# EAGLE design langProject (EAGLE 8.0.1)
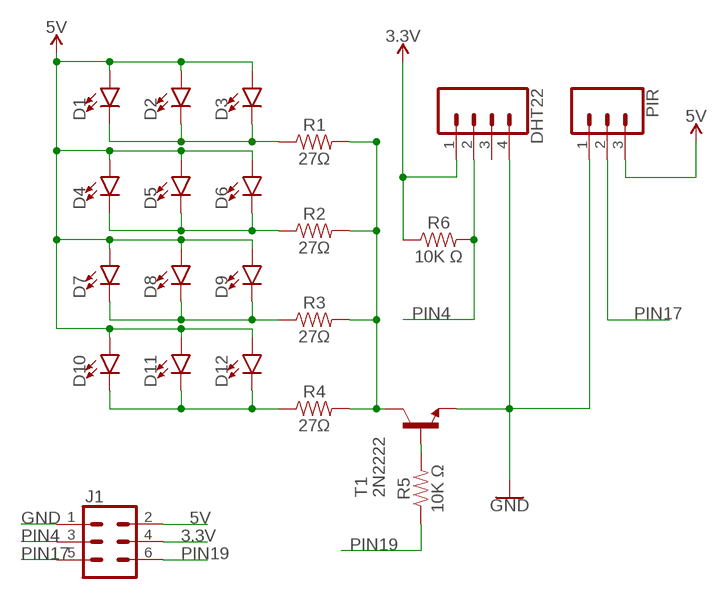
[diagram p0: schematic, sheet 1]

## Parts
D1  LED5MM  [LED_5MM]
D2  LED5MM  [LED_5MM]
D3  LED5MM  [LED_5MM]
D4  LED5MM  [LED_5MM]
D5  LED5MM  [LED_5MM]
D6  LED5MM  [LED_5MM]
D7  LED5MM  [LED_5MM]
D8  LED5MM  [LED_5MM]
D9  LED5MM  [LED_5MM]
D10  LED5MM  [LED_5MM]
D11  LED5MM  [LED_5MM]
D12  LED5MM  [LED_5MM]
DHT22  CONN_04LONGPADS  [1X04_LONGPADS]
J1  CONN_03X2SHROUD  [2X3-SHROUDED]
PIR  CONN_03LONGPADS  [1X03_LONGPADS]
R1  27Ω  10OHM-HORIZ_KIT-1/4W-1%  [AXIAL-0.3-KIT]
R2  27Ω  10OHM-HORIZ_KIT-1/4W-1%  [AXIAL-0.3-KIT]
R3  27Ω  10OHM-HORIZ_KIT-1/4W-1%  [AXIAL-0.3-KIT]
R4  27Ω  10OHM-HORIZ_KIT-1/4W-1%  [AXIAL-0.3-KIT]
R5  10K Ω  10OHM-HORIZ_KIT-1/4W-1%  [AXIAL-0.3-KIT]
R6  10K Ω  10OHM-HORIZ_KIT-1/4W-1%  [AXIAL-0.3-KIT]
T1  2N2222  [TO92-EBC-OVAL]

## Nets
3.3V: DHT22.1 J1.4 R6.P$1
5V: D1.A D2.A D3.A D4.A D5.A D6.A D7.A D8.A D9.A D10.A D11.A D12.A J1.2 PIR.3
GND: DHT22.4 J1.1 PIR.1 T1.E
N$1: D1.K(C) D2.K(C) D3.K(C) R1.P$1
N$2: D4.K(C) D5.K(C) D6.K(C) R2.P$1
N$3: D7.K(C) D8.K(C) D9.K(C) R3.P$1
N$4: R5.P$2 T1.B
N$5: D10.K(C) D11.K(C) D12.K(C) R4.P$1
N$6: R1.P$2 R2.P$2 R3.P$2 R4.P$2 T1.C
PIN4: DHT22.2 J1.3 R6.P$2
PIN17: J1.5 PIR.2
PIN19: J1.6 R5.P$1
Unconnected: DHT22.3

## Library data of the parts
D1-D12 = SparkFun-LED:LED: LED (Generic) Standard schematic elements and footprints for 5mm, 3mm, 1206, and 0603 sized LEDs. Generic LEDs with no color specified.
DHT22 = SparkFun-Connectors:CONN_04: Multi connection point. Often used as Generic Header-pin footprint for 0.1 inch spaced/style header connections On any of the 0.1 inch spaced packages, you can populate with these: Break Away Headers - Straight <https://www.sparkfun.com/products/116> (PRT-00116) Break Away Male Headers - Right Angle <https://www.sparkfun.com/products/553> (PRT-00553) Female Headers <https://www.sparkfun.com/products/115> (PRT-00115) Break Away Headers - Machine Pin <https://www.sparkfun.com/products/117> (PRT-00117) Break Away Female Headers - Swiss Machine Pin <https://www.sparkfun.com/products/743> (PRT-00743) For SCREWTERMINALS and SPRING TERMINALS visit here: Screw Terimnals on SparkFun.com <https://www.sparkfun.com/search/results?term=Screw+Terminals> (5mm/3.5mm/2.54mm spacing) This device is also useful as a general connection point to wire up your design to another part of your project. Our various solder wires solder well into these plated through hole pads. Hook-Up Wire - Assortment (Stranded, 22 AWG) <https://www.sparkfun.com/products/11375> (PRT-11375) Hook-Up Wire - Assortment (Solid Core, 22 AWG) <https://www.sparkfun.com/products/11367> (PRT-11367) View the entire wire category on our website here <https://www.sparkfun.com/categories/141> Special notes: Molex polarized connector foot print use with SKU : PRT-08231 with associated crimp pins and housings. 1MM SMD Version SKU: PRT-10208; PROD_ID: CONN-09696
J1 = SparkFun-Connectors:CONN_03X2: Multi connection point. Often used as Generic Header-pin footprint for 0.1 inch spaced/style header connections You can populate with any combo of single row headers, but if you'd like an exact match, check these: Header - 2x3 (Male, 0.1") <https://www.sparkfun.com/products/12807> (PRT-12807) Header - 2x3 (Female, 0.1") <https://www.sparkfun.com/products/13010> (PRT-13010) 2x3 Pin Shrouded Header <https://www.sparkfun.com/products/10877> (PRT-10877) On any of the 0.1 inch spaced packages, you can populate with these: Break Away Headers - Straight <https://www.sparkfun.com/products/116> (PRT-00116) Break Away Male Headers - Right Angle <https://www.sparkfun.com/products/553> (PRT-00553) Female Headers <https://www.sparkfun.com/products/115> (PRT-00115) Break Away Headers - Machine Pin <https://www.sparkfun.com/products/117> (PRT-00117) Break Away Female Headers - Swiss Machine Pin <https://www.sparkfun.com/products/743> (PRT-00743) Special note: the shrouded connector mates well with our 3x2 ribbon cables: Ribbon Crimp Connector - 6-pin (2x3, Female) <https://www.sparkfun.com/products/10651> (PRT-10651) Ribbon Cable - 6 wire (15ft) <https://www.sparkfun.com/products/10646> (PRT-10646); PROD_ID: CONN-10681; SF_ID: PRT_10877
PIR = SparkFun-Connectors:CONN_03: Multi connection point. Often used as Generic Header-pin footprint for 0.1 inch spaced/style header connections On any of the 0.1 inch spaced packages, you can populate with these: Break Away Headers - Straight <https://www.sparkfun.com/products/116> (PRT-00116) Break Away Male Headers - Right Angle <https://www.sparkfun.com/products/553> (PRT-00553) Female Headers <https://www.sparkfun.com/products/115> (PRT-00115) Break Away Headers - Machine Pin <https://www.sparkfun.com/products/117> (PRT-00117) Break Away Female Headers - Swiss Machine Pin <https://www.sparkfun.com/products/743> (PRT-00743) Stackable Header - 3 Pin (Female, 0.1") <https://www.sparkfun.com/products/13875> (PRT-13875) For SCREWTERMINALS and SPRING TERMINALS visit here: Screw Terimnals on SparkFun.com <https://www.sparkfun.com/search/results?term=Screw+Terminals> (5mm/3.5mm/2.54mm spacing) This device is also useful as a general connection point to wire up your design to another part of your project. Our various solder wires solder well into these plated through hole pads. Hook-Up Wire - Assortment (Stranded, 22 AWG) <https://www.sparkfun.com/products/11375> (PRT-11375) Hook-Up Wire - Assortment (Solid Core, 22 AWG) <https://www.sparkfun.com/products/11367> (PRT-11367) View the entire wire category on our website here <https://www.sparkfun.com/categories/141> Special notes: Molex polarized connector foot print use with SKU : PRT-08232 with associated crimp pins and housings.
R1-R6 = SparkFun-Resistors:10OHM: 10Ω resistor A resistor is a passive two-terminal electrical component that implements electrical resistance as a circuit element. Resistors act to reduce current flow, and, at the same time, act to lower voltage levels within circuits. - Wikipedia; PROD_ID: RES-12180; VALUE: 10
T1 = adafruit:2N2222: NPN TRANSISTOR Big oval pads

## Board
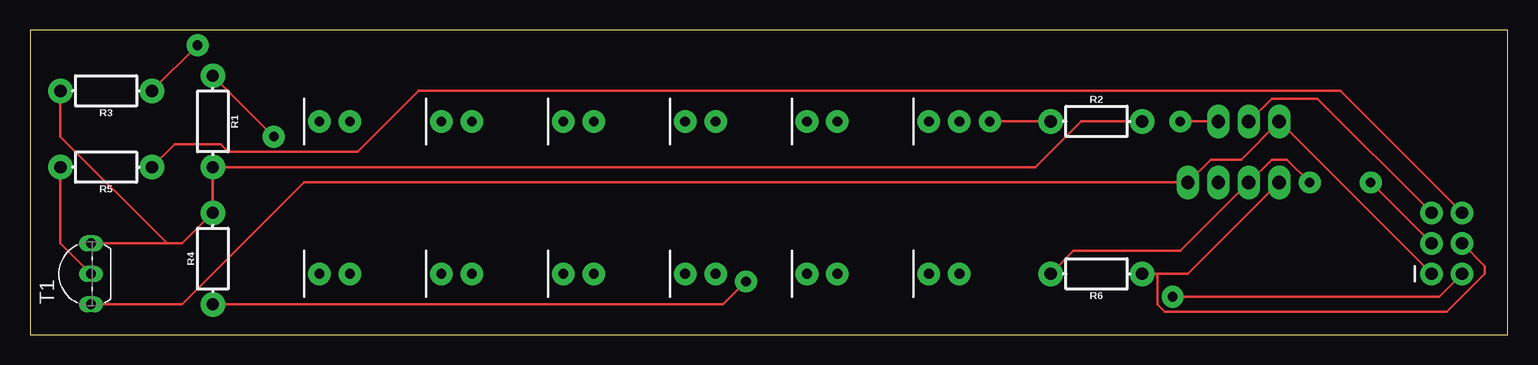
[diagram p1: board, top side]
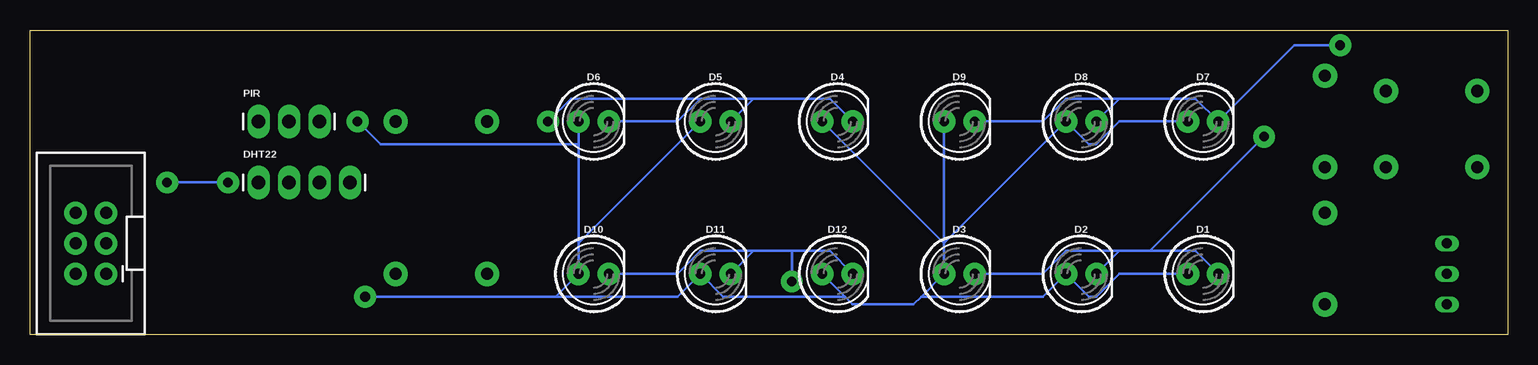
[diagram p2: board, bottom side, seen from below]

Size 123.19 x 25.4 mm. Coordinates in mm from the lower left corner, seen from the top.
Outline: 0,0 123.19,0 123.19,25.4 0,25.4 0,0
Copper layers (1*16): Top 0.035mm / dielectric 1.5mm / Bottom 0.035mm
Design rules "OthermillDRC_1_100_v2 *": minimum track width 8mil, minimum drill 0.8mm, track to track 0.256540625mm, track to pad 0.256540625mm, pad to pad 0.256540625mm, via to via 0.256540625mm, smd to smd 0mil, copper to edge 0mil, drill to drill 1mil, minimum pad ring 10mil, minimum via ring 20mil, stop-mask expansion 1mil, vias tented up to drill 30mil, thermal gap 10mil
tRestrict: area 53.3,3.8 to 58.4,6.3; area 22.9,16.5 to 27.9,19.1; area 43.2,16.5 to 48.3,19.1; area 53.3,16.5 to 58.4,19.1; area 63.5,16.5 to 68.6,19.1; area 73.7,16.5 to 78.7,19.1; area 43.2,3.8 to 48.3,6.3; area 33,16.5 to 38.1,19.1; area 63.5,3.8 to 68.6,6.3; area 73.7,3.8 to 78.7,6.3; area 33,3.8 to 38.1,6.3; area 22.9,3.8 to 27.9,6.3
bRestrict: area 115.6,3.8 to 120.7,11.4; area 3.8,1.3 to 6.3,8.9; area 1.3,19.1 to 11.4,21.6; area 1.3,12.7 to 11.4,15.2; area 14,12.7 to 16.5,22.9; area 83.8,16.5 to 94,19.1; area 14,1.3 to 16.5,11.4; area 83.8,3.8 to 94,6.3; area 97.8,16.5 to 105.4,19.1; area 95.2,11.4 to 105.4,14
vRestrict: area 113,0 to 123.2,15.2

### Footprints (pad centres in the part's own frame; a part is rotated, then mirrored left to right if it is on the bottom)
LED_5MM = drill 0.813 pad 1.88: A -1.27,0; K 1.27,0
1X04_LONGPADS = drill 1.118 pad 1.88 long: 1 0,0; 2 2.54,0; 3 5.08,0; 4 7.62,0
2X3-SHROUDED = drill 1.016 pad 1.88: 1 -1.27,2.54; 2 1.27,2.54; 3 -1.27,0; 4 1.27,0; 5 -1.27,-2.54; 6 1.27,-2.54
1X03_LONGPADS = drill 1.118 pad 1.88 long: 1 0,0; 2 2.54,0; 3 5.08,0
AXIAL-0.3-KIT = drill 1.016 pad 2.032: P$1 -3.81,0; P$2 3.81,0
TO92-EBC-OVAL = drill 0.813 long: B 0,-1.27; C 2.54,-1.27; E -2.54,-1.27

### Placement (x,y rotation side)
D1  25.4,5.08 0 bottom
D2  35.56,5.08 0 bottom
D3  45.72,5.08 0 bottom
D4  55.88,17.78 0 bottom
D5  66.04,17.78 0 bottom
D6  76.2,17.78 0 bottom
D7  25.4,17.78 0 bottom
D8  35.56,17.78 0 bottom
D9  45.72,17.78 0 bottom
D10  76.2,5.08 0 bottom
D11  66.04,5.08 0 bottom
D12  55.88,5.08 0 bottom
DHT22  104.14,12.7 0 bottom
J1  118.11,7.62 180 bottom
PIR  104.14,17.78 0 bottom
R1  15.24,17.78 270 top
R2  88.9,17.78 0 top
R3  6.35,20.32 180 top
R4  15.24,6.35 90 top
R5  6.35,13.97 180 top
R6  88.9,5.08 180 top
T1  3.81,5.08 90 top

### Tracks (layer width: path | path; a pad name or v marks a point on that pad's centre or on a via)
3.3V
  Top 0.203: DHT22.1 96.52,5.08 93.98,5.08 | R6.P$1 93.98,5.08 | J1.4 121.28,5.71 121.28,5.08 118.11,1.91 94.61,1.91 93.98,2.54 93.98,5.08
5V  (via drill 0.8)
  Top 0.203: J1.2 117.47,3.17 v95.25,3.17 | v95.89,17.78 PIR.3
  Bottom 0.203: D7.A 32.38,17.78 34.29,15.88 34.92,15.88 D8.A 46.99,7.62 | D1.A 32.38,5.08 34.29,3.17 34.92,3.17 D2.A 38.73,3.17 48.9,3.17 | D9.A 46.99,7.62 | 46.99,7.62 D3.A 48.9,3.17 | 55.24,3.17 54.61,2.54 49.53,2.54 48.9,3.17 | 55.24,3.17 D12.A | 55.24,3.17 65.41,3.17 D11.A 69.22,3.17 79.38,3.17 | 46.99,7.62 D4.A | D6.A 77.47,15.88 | 77.47,15.88 77.47,7.62 | 77.47,7.62 D10.A 79.38,3.17 | 79.38,3.17 v95.25,3.17 | 77.47,7.62 D5.A | v95.89,17.78 93.98,15.88 77.47,15.88
GND
  Top 0.203: J1.1 PIR.1 100.97,14.61 98.42,14.61 DHT22.4 22.86,12.7 12.7,2.54 T1.E
N$1  (via drill 0.8)
  Top 0.203: v20.32,16.51 R1.P$1
  Bottom 0.203: D1.K 26.04,6.99 29.84,6.99 | 32.38,6.99 29.84,6.99 | D2.K 32.38,6.99 | D3.K 38.73,5.08 36.83,6.99 32.38,6.99 | 29.84,6.99 v20.32,16.51
N$2  (via drill 0.8)
  Top 0.203: v80.01,17.78 R2.P$1
  Bottom 0.203: D4.K 56.52,19.68 62.87,19.68 | D5.K 62.87,19.68 | D6.K 69.22,17.78 67.31,19.68 | 62.87,19.68 67.31,19.68 | v80.01,17.78 78.11,19.68 67.31,19.68
N$3  (via drill 0.8)
  Top 0.203: v13.97,24.13 R3.P$1
  Bottom 0.203: 32.38,19.68 26.04,19.68 D7.K 17.78,24.13 v13.97,24.13 | D8.K 32.38,19.68 | D9.K 38.73,17.78 36.83,19.68 32.38,19.68
N$4
  Top 0.203: T1.B 2.54,7.62 R5.P$2
N$5  (via drill 0.8)
  Top 0.203: R4.P$1 57.78,2.54 v59.69,4.45
  Bottom 0.203: D12.K 56.52,6.99 59.69,6.99 | 62.87,6.99 59.69,6.99 | D11.K 62.87,6.99 | D10.K 69.22,5.08 67.31,6.99 62.87,6.99 | 59.69,6.99 v59.69,4.45
N$6
  Top 0.203: 11.43,7.62 12.7,7.62 R4.P$2 R1.P$2 83.82,13.97 87.63,17.78 R2.P$2 | 11.43,7.62 T1.C | R3.P$2 2.54,16.51 11.43,7.62
PIN4  (via drill 0.8)
  Top 0.203: R6.P$2 87,6.99 95.89,6.99 DHT22.2 103.5,14.61 104.78,14.61 v106.68,12.7 | v111.76,12.7 J1.3
  Bottom 0.203: v106.68,12.7 v111.76,12.7
PIN17
  Top 0.203: PIR.2 103.5,19.68 107.31,19.68 J1.5
PIN19
  Top 0.203: J1.6 109.22,20.32 32.38,20.32 27.3,15.24 16.51,15.24 15.88,15.88 12.06,15.88 R5.P$1